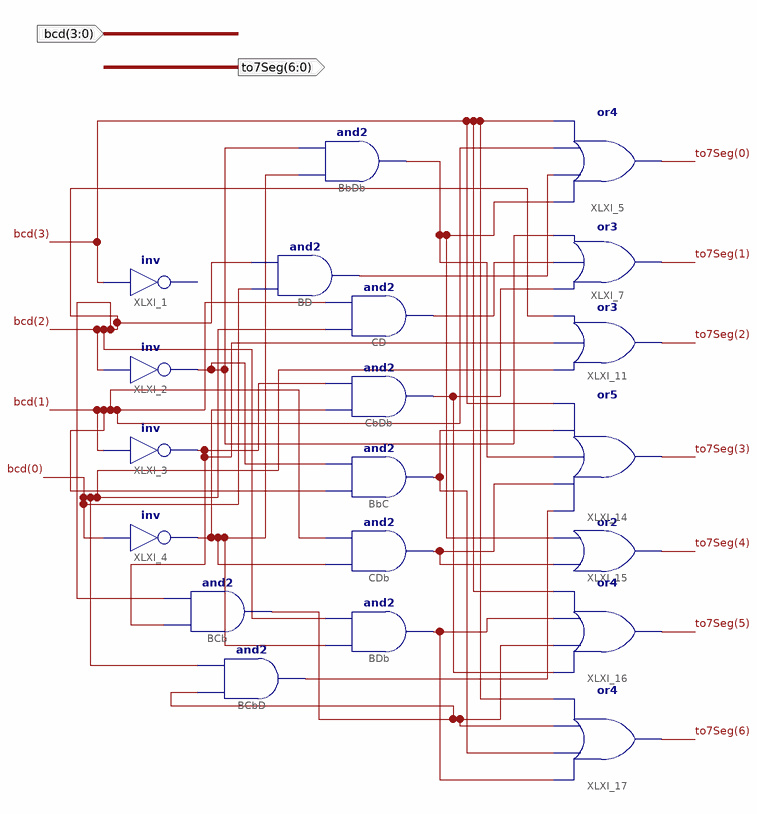
[diagram p0: schematic sheet 1]
// Xilinx ISE schematic decoder7segment.sch (spartan6) as structural Verilog: 20 symbols, 2 ports
module decoder7segment (
  input  [3:0] bcd,
  output [6:0] to7Seg
);

  wire XLXN_87, XLXN_91, XLXN_92, XLXN_97, XLXN_101, XLXN_104, XLXN_106, XLXN_107, XLXN_108, XLXN_111,
       XLXN_113, XLXN_114;

  // inv XLXI_1 has open pins: I=bcd[3], O=open
  not XLXI_2 (XLXN_87, bcd[2]);
  not XLXI_3 (XLXN_92, bcd[1]);
  not XLXI_4 (XLXN_91, bcd[0]);
  or XLXI_11 (to7Seg[2], bcd[0], XLXN_92, bcd[2]);
  or XLXI_7 (to7Seg[1], XLXN_111, XLXN_101, XLXN_87);
  or XLXI_5 (to7Seg[0], XLXN_107, XLXN_97, bcd[1], bcd[3]);
  and CD (XLXN_101, bcd[0], bcd[1]);
  and CbDb (XLXN_111, XLXN_91, XLXN_92);
  and BbC (XLXN_104, bcd[1], XLXN_87);
  and CDb (XLXN_108, XLXN_91, bcd[1]);
  and BDb (XLXN_114, XLXN_91, bcd[2]);
  or XLXI_15 (to7Seg[4], XLXN_108, XLXN_107);
  or XLXI_16 (to7Seg[5], XLXN_111, XLXN_113, XLXN_114, bcd[3]);
  or XLXI_17 (to7Seg[6], XLXN_114, XLXN_104, XLXN_113, bcd[3]);
  or XLXI_14 (to7Seg[3], XLXN_106, XLXN_108, XLXN_107, XLXN_104, bcd[3]);
  and BbDb (XLXN_107, XLXN_91, XLXN_87);
  and BCb (XLXN_113, XLXN_92, bcd[2]);
  and BCbD (XLXN_106, XLXN_113, bcd[0]);
  and BD (XLXN_97, bcd[0], bcd[2]);
endmodule
